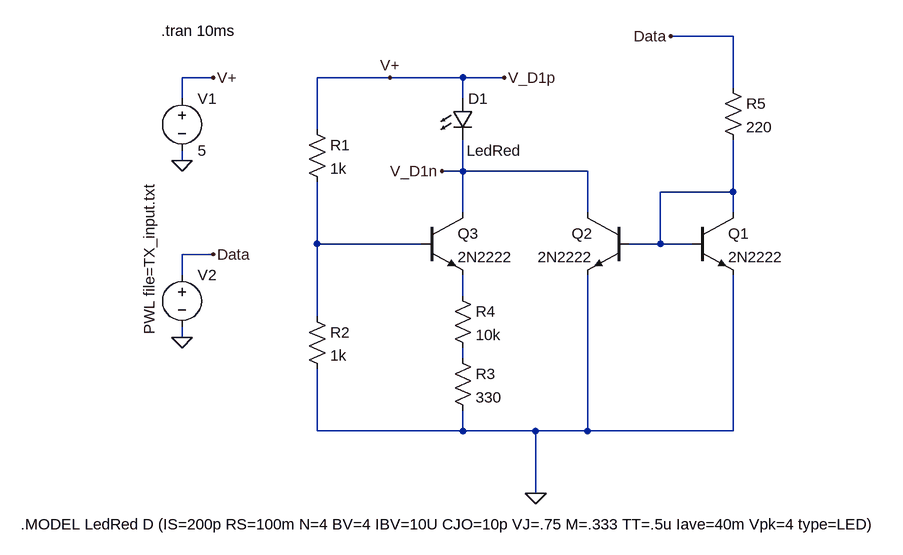
[diagram p0: schematic transmissor.asc]
transmissor.asc, the LTspice schematic file:
Version 4
SHEET 1 1368 680
WIRE 1008 -176 912 -176
WIRE 208 -112 160 -112
WIRE 480 -112 368 -112
WIRE 592 -112 480 -112
WIRE 656 -112 592 -112
WIRE 1008 -96 1008 -176
WIRE 160 -80 160 -112
WIRE 592 -80 592 -112
WIRE 368 -32 368 -112
WIRE 160 16 160 0
WIRE 592 32 592 -16
WIRE 592 32 560 32
WIRE 784 32 592 32
WIRE 1008 64 1008 -16
WIRE 1008 64 896 64
WIRE 592 96 592 32
WIRE 784 96 784 32
WIRE 1008 96 1008 64
WIRE 368 144 368 48
WIRE 528 144 368 144
WIRE 896 144 896 64
WIRE 896 144 848 144
WIRE 944 144 896 144
WIRE 208 160 160 160
WIRE 160 192 160 160
WIRE 592 224 592 192
WIRE 368 256 368 144
WIRE 160 288 160 272
WIRE 592 320 592 304
WIRE 368 432 368 336
WIRE 592 432 592 400
WIRE 592 432 368 432
WIRE 704 432 592 432
WIRE 784 432 784 192
WIRE 784 432 704 432
WIRE 1008 432 1008 192
WIRE 1008 432 784 432
WIRE 704 528 704 432
FLAG 160 288 0
FLAG 160 16 0
FLAG 704 528 0
FLAG 208 -112 V+
FLAG 208 160 Data
FLAG 912 -176 Data
FLAG 480 -112 V+
FLAG 656 -112 V_D1p
FLAG 560 32 V_D1n
SYMBOL voltage 160 -96 R0
WINDOW 123 0 0 Left 0
WINDOW 39 0 0 Left 0
SYMATTR InstName V1
SYMATTR Value 5
SYMBOL voltage 160 176 R0
WINDOW 3 -50 -125 VRight 2
WINDOW 123 32 117 Left 2
WINDOW 39 0 0 Left 0
SYMATTR Value PWL file=TX_input.txt
SYMATTR InstName V2
SYMBOL res 352 240 R0
SYMATTR InstName R2
SYMATTR Value 1k
SYMBOL res 576 304 R0
SYMATTR InstName R3
SYMATTR Value 330
SYMBOL res 352 -48 R0
SYMATTR InstName R1
SYMATTR Value 1k
SYMBOL npn 528 96 R0
SYMATTR InstName Q3
SYMATTR Value 2N2222
SYMBOL npn 848 96 M0
SYMATTR InstName Q2
SYMATTR Value 2N2222
SYMBOL npn 944 96 R0
SYMATTR InstName Q1
SYMATTR Value 2N2222
SYMBOL LED 576 -80 R0
WINDOW 3 22 80 Left 2
SYMATTR Value LedRed
SYMATTR InstName D1
SYMBOL res 992 -112 R0
SYMATTR InstName R5
SYMATTR Value 220
SYMBOL res 576 208 R0
SYMATTR InstName R4
SYMATTR Value 10k
TEXT 128 -184 Left 2 !.tran 10ms
TEXT -88 576 Left 2 !.MODEL LedRed D (IS=200p RS=100m N=4 BV=4 IBV=10U CJO=10p VJ=.75 M=.333 TT=.5u Iave=40m Vpk=4 type=LED)

The netlist it stands for:
* transmissor.asc
V1 V_D1p 0 5
V2 Data 0 PWL file=TX_input.txt
R2 N002 0 1k
R3 N004 0 330
R1 V_D1p N002 1k
Q3 V_D1n N002 N003 0 2N2222
Q2 V_D1n N001 0 0 2N2222
Q1 N001 N001 0 0 2N2222
D1 V_D1p V_D1n LedRed
R5 Data N001 220
R4 N003 N004 10k
.model D D
.lib standard.dio
.model NPN NPN
.model PNP PNP
.lib standard.bjt
.tran 10ms
.MODEL LedRed D (IS=200p RS=100m N=4 BV=4 IBV=10U CJO=10p VJ=.75 M=.333 TT=.5u Iave=40m Vpk=4 type=LED)
.backanno
.end